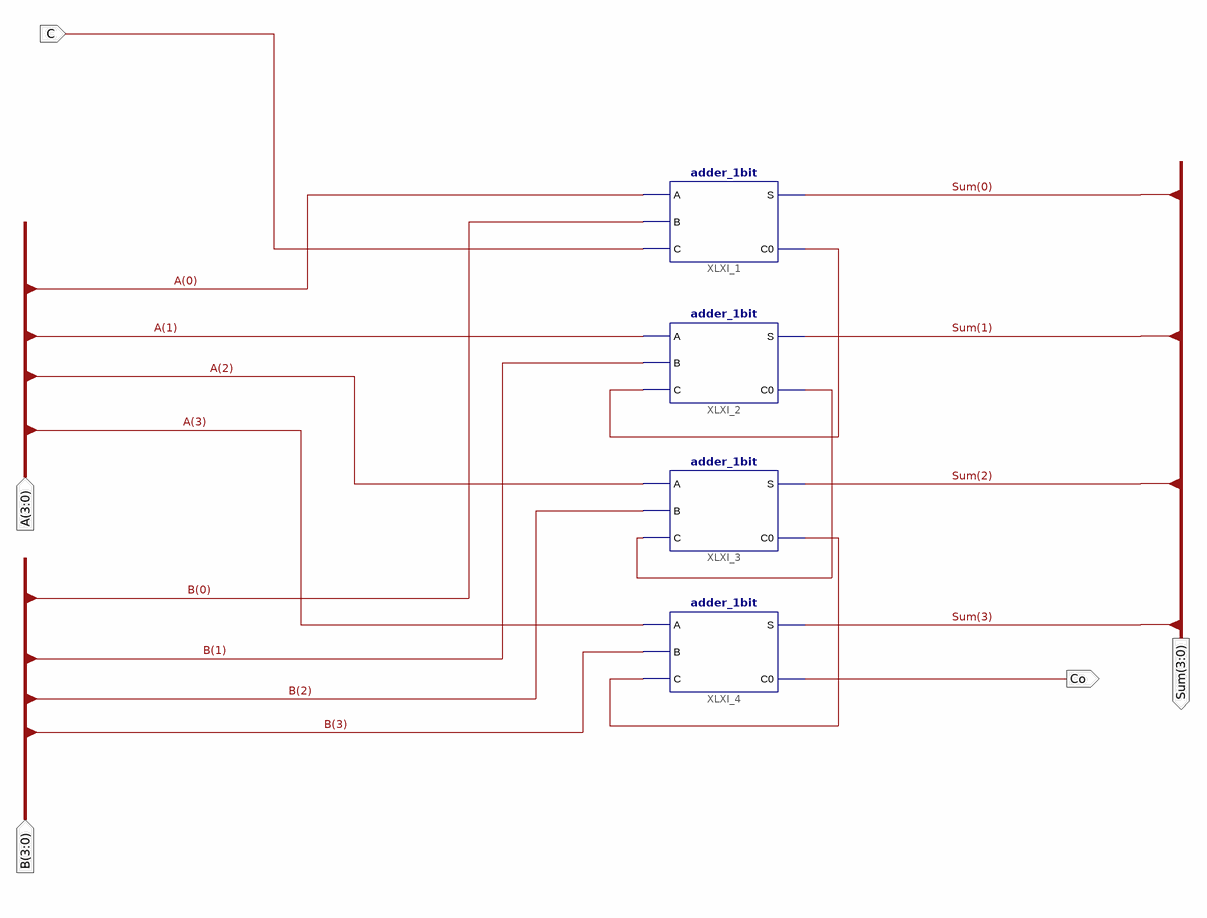
[diagram p0: schematic sheet 1]
// Xilinx ISE schematic Adder4.sch (kintex7) as structural Verilog: 4 symbols, 5 ports
module Adder4 (
  input  [3:0] A,
  input  [3:0] B,
  input  C,
  output Co,
  output [3:0] Sum
);

  wire XLXN_15, XLXN_16, XLXN_18;

  adder_1bit XLXI_1 (.A(A[0]), .B(B[0]), .C(C), .S(Sum[0]), .C0(XLXN_15));
  adder_1bit XLXI_2 (.A(A[1]), .B(B[1]), .C(XLXN_15), .S(Sum[1]), .C0(XLXN_18));
  adder_1bit XLXI_3 (.A(A[2]), .B(B[2]), .C(XLXN_18), .S(Sum[2]), .C0(XLXN_16));
  adder_1bit XLXI_4 (.A(A[3]), .B(B[3]), .C(XLXN_16), .S(Sum[3]), .C0(Co));
endmodule
